# Altium schematic sheet CUSensor.SchDoc
size B; Engineer: Dan Dina; Organization: Altium Limited; Address1: 61 Oakwood Rd.; Address2: Lake Zurich, IL 60047; Revision: C; SheetNumber: 1; SheetTotal: 1; ProjectName: *ProjectName
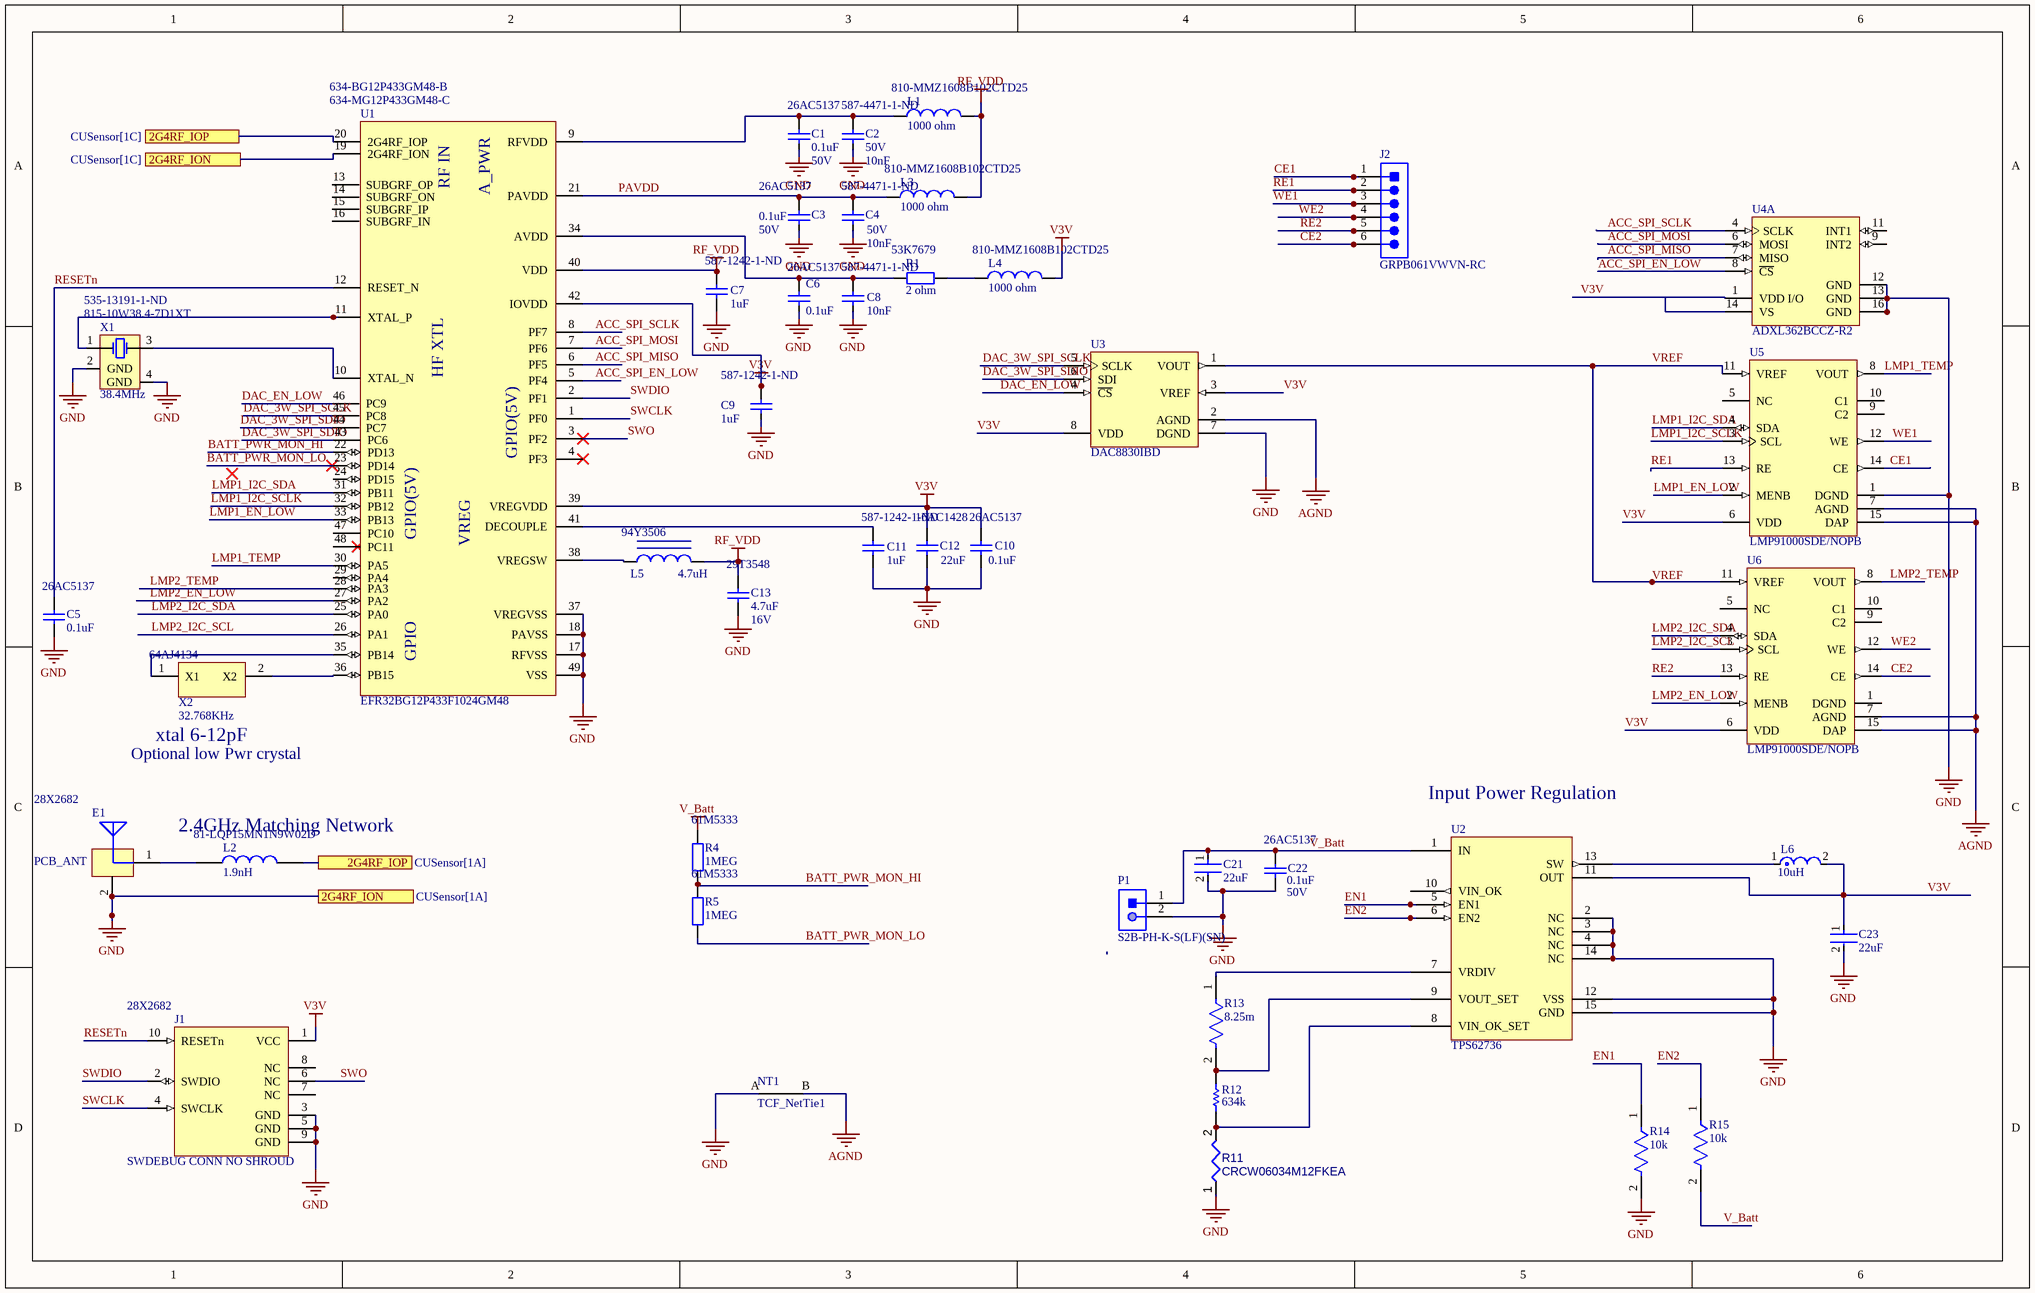
[diagram p0: CUSensor.SchDoc]

## Parts
C1  value 0.1uF  Voltage: 50V  Supplier Part Number 1: 26AC5137  [RESC1608N]  (hidden comment: CAP CER .1UF 50V 10% X7R 0603)
C2  value 10nF  Voltage: 50V  Supplier Part Number 1: 587-4471-1-ND  [RESC1608N]  (hidden comment: CAP CER 10nF 50V 10% X7R 0603)
C3  value 0.1uF  Voltage: 50V  Supplier Part Number 1: 26AC5137  [RESC1608N]  (hidden comment: CAP CER .1UF 50V 10% X7R 0603)
C4  value 10nF  Voltage: 50V  Supplier Part Number 1: 587-4471-1-ND  [RESC1608N]  (hidden comment: CAP CER 10nF 50V 10% X7R 0603)
C5  value 0.1uF  Supplier Part Number 1: 26AC5137  [RESC1608N]  (hidden comment: CAP CER .1UF 50V 10% X7R 0603)
C6  value 0.1uF  Supplier Part Number 1: 26AC5137  [RESC1608N]  (hidden comment: CAP CER .1UF 50V 10% X7R 0603)
C7  value 1uF  Supplier Part Number 1: 587-1242-1-ND  [RESC1608N]  (hidden comment: CAP CER 1UF 10V)
C8  value 10nF  Supplier Part Number 1: 587-4471-1-ND  [RESC1608N]  (hidden comment: CAP CER 10nF 50V 10% X7R 0603)
C9  value 1uF  Supplier Part Number 1: 587-1242-1-ND  [RESC1608N]  (hidden comment: CAP CER 1UF 10V)
C10  value 0.1uF  Supplier Part Number 1: 26AC5137  [RESC1608N]  (hidden comment: CAP CER .1UF 50V 10% X7R 0603)
C11  value 1uF  Supplier Part Number 1: 587-1242-1-ND  [RESC1608N]  (hidden comment: CAP CER 1UF 10V)
C12  value 22uF  Supplier Part Number 1: 16AC1428  [RESC1608N]  (hidden comment: Cap 22uF 0603)
C13  value 4.7uF  Voltage: 16V  Supplier Part Number 1: 29T3548  [RESC1608N]  (hidden comment: CAP 4.7uF  0603)
C21  22uF  [FP-GCJ31C-0_3-IPC_B]
C22  value 0.1uF  Voltage: 50V  Supplier Part Number 1: 26AC5137  [RESC1608N]  (hidden comment: CAP CER .1UF 50V 10% X7R 0603)
C23  22uF  [FP-GCJ31C-0_3-IPC_B]
E1  PCB_ANT  Supplier Part Number 1: 28X2682  [PCB_ANT_2.4GHz CIRCULAR]  (no BOM)
J1  SWDEBUG CONN NO SHROUD  Supplier Part Number 1: 28X2682  [CONN SMT 10 pin Dual Row - 0.050" FCI shroudless]
J2  GRPB061VWVN-RC  [SLIN-GRPB061VWVN-RC_V]
L1  value 1000 ohm  Supplier Part Number 1: 810-MMZ1608B102CTD25  [RESC1608N]  (hidden comment: MMZ1608B102C)
L2  value 1.9nH  Supplier Part Number 1: 81-LQP15MN1N9W02D  [RESC1005N]  (hidden comment: Inductor 1.9nH)
L3  value 1000 ohm  Supplier Part Number 1: 810-MMZ1608B102CTD25  [RESC1608N]  (hidden comment: MMZ1608B102C)
L4  value 1000 ohm  Supplier Part Number 1: 810-MMZ1608B102CTD25  [RESC1608N]  (hidden comment: MMZ1608B102C)
L5  value 4.7uH  Supplier Part Number 1: 94Y3506  [RESC2016N]  (hidden comment: 4.7uH 900mA)
L6  10uH  [FP-LPS4018-MFG]
NT1  TCF_NetTie1  [TCF_NetTie1-Footprint-1]  (net tie, no BOM)
P1  S2B-PH-K-S(LF)(SN)  [JST-S2B-PH-K-S_V]
R1  value 2 ohm  Supplier Part Number 1: 53K7679  [RESC1608N]  (hidden comment: RC1608F2R0CS)
R4  Supplier Part Number 1: 61M5333  [RESC1608N]  (hidden comment: 1MEG)
R5  Supplier Part Number 1: 61M5333  [RESC1608N]  (hidden comment: 1MEG)
R11  CRCW06034M12FKEA  [RESC1608X05N]
R12  634k  [RESC1609X50X30LL10T20]
R13  8.25m  [FP-CRCW0603-e3-IPC_B]
R14  10k  [FP-RT0603-MFG]
R15  10k  [FP-RT0603-MFG]
U1  EFR32BG12P433F1024GM48  Supplier Part Number 1: 634-MG12P433GM48-C  Supplier Part Number 2: 634-BG12P433GM48-B  [QFN50P700X700X90_HS-49N]
U2  TPS62736  [QFN127P600-8N]
U3  DAC8830IBD  [TI-D8_M]
U4  ADXL362BCCZ-R2  [ADI-CC-16-4_M]  (part A of 2)
U5  LMP91000SDE/NOPB  [NHL0014B_V]
U6  LMP91000SDE/NOPB  [NHL0014B_V]
X1  38.4MHz  Supplier Part Number 1: 815-10W38.4-7D1XT  Supplier Part Number 2: 535-13191-1-ND  [CRYSTAL SMD 2.5x2.0 ABRACON]
X2  32.768KHz  Supplier Part Number 1: 64AJ4134  [Crystal_SMD_3.2x1.5mm]

## Ports
2G4RF_ION (see CUSensor[1A]), 2G4RF_ION (see CUSensor[1C]), 2G4RF_IOP (see CUSensor[1A]), 2G4RF_IOP (see CUSensor[1C])

## Nets
AGND: NT1.B U3.2(AGND) U5.7(AGND) U5.15(DAP) U6.7(AGND) U6.15(DAP)
GND: C1.1 C2.1 C3.1 C4.1 C5.2 C6.1 C7.1 C8.1 C9.1 C10.1 C11.1 C12.1 C13.1 C21.2 C22.1 C23.2 E1.2(GND) J1.3(GND) J1.5(GND) J1.9(GND) NT1.A P1.2 R11.1 R14.2 U1.17(RFVSS) U1.18(PAVSS) U1.19(2G4RF_ION) U1.37(VREGVSS) U1.49(VSS) U2.2(NC) U2.3(NC) U2.4(NC) U2.12(VSS) U2.14(NC) U2.15(GND) U3.7(DGND) U4.12(GND) U4.13(GND) U4.16(GND) U5.1(DGND) X1.2(GND) X1.4(GND) ; port 2G4RF_ION
RF_VDD: C7.2 C13.2 L1.2 L3.2 L5.2 U1.40(VDD)
V3V: C9.2 C10.2 C12.2 C23.1 J1.1(VCC) L4.2 L6.2 U1.39(VREGVDD) U1.42(IOVDD) U2.11(OUT) U3.3(VREF) U3.8(VDD) U4.1(VDD_I/O) U4.14(VS) U5.6(VDD) U6.6(VDD)
V_Batt: C21.1 C22.2 P1.1 R4.2 R15.2 U2.1(IN)
2G4RF_IOP: L2.2 U1.20(2G4RF_IOP) ; port 2G4RF_IOP
ACC_SPI_EN_LOW: U1.5(PF4) U4.8(~{CS})
ACC_SPI_MISO: U1.6(PF5) U4.7(MISO)
ACC_SPI_MOSI: U1.7(PF6) U4.6(MOSI)
ACC_SPI_SCLK: U1.8(PF7) U4.4(SCLK)
BATT_PWR_MON_HI: R4.1 R5.2 U1.22(PD13)
BATT_PWR_MON_LO: R5.1 U1.23(PD14)
CE1: J2.1 U5.14(CE)
CE2: J2.6 U6.14(CE)
DAC_3W_SPI_SCLK: U1.45(PC8) U3.5(SCLK)
DAC_3W_SPI_SDIO: U1.43(PC6) U1.44(PC7) U3.6(SDI)
DAC_EN_LOW: U1.46(PC9) U3.4(~{CS})
EN1: R14.1 U2.5(EN1)
EN2: R15.1 U2.6(EN2)
LMP1_EN_LOW: U1.33(PB13) U5.2(MENB)
LMP1_I2C_SCLK: U1.32(PB12) U5.3(SCL)
LMP1_I2C_SDA: U1.31(PB11) U5.4(SDA)
LMP1_TEMP: U1.30(PA5) U5.8(VOUT)
LMP2_EN_LOW: U1.27(PA2) U6.2(MENB)
LMP2_I2C_SCL: U1.26(PA1) U6.3(SCL)
LMP2_I2C_SDA: U1.25(PA0) U6.4(SDA)
LMP2_TEMP: U1.28(PA3) U6.8(VOUT)
PAVDD: C3.2 C4.2 L3.1 U1.21(PAVDD)
RE1: J2.2 U5.13(RE)
RE2: J2.5 U6.13(RE)
RESETn: C5.1 J1.10(RESETn) U1.12(RESET_N)
SWCLK: J1.4(SWCLK) U1.1(PF0)
SWDIO: J1.2(SWDIO) U1.2(PF1)
SWO: J1.6(NC) U1.3(PF2)
VREF: U3.1(VOUT) U5.11(VREF) U6.11(VREF)
WE1: J2.3 U5.12(WE)
WE2: J2.4 U6.12(WE)
NetC1_2: C1.2 C2.2 L1.1 U1.9(RFVDD)
NetC6_2: C6.2 C8.2 R1.1 U1.34(AVDD)
NetC11_2: C11.2 U1.41(DECOUPLE)
NetE1_1: E1.1(SIG) L2.1
NetL4_1: L4.1 R1.2
NetL5_1: L5.1 U1.38(VREGSW)
NetL6_1: L6.1 U2.13(SW)
NetR11_2: R11.2 R12.1 U2.8(VIN_OK_SET)
NetR12_2: R12.2 R13.2 U2.9(VOUT_SET)
NetR13_1: R13.1 U2.7(VRDIV)
NetU1_10: U1.10(XTAL_N) X1.3(OSC2)
NetU1_11: U1.11(XTAL_P) X1.1(OSC1)
NetU1_35: U1.35(PB14) X2.1(X1)
NetU1_36: U1.36(PB15) X2.2(X2)

Not connected (* = marked no-connect by the designer): J1 7(NC) 8(NC); U1 4(PF3)* 13(SUBGRF_OP) 14(SUBGRF_ON) 15(SUBGRF_IP) 16(SUBGRF_IN) 24(PD15) 29(PA4) 47(PC10) 48(PC11); U2 10(VIN_OK); U4 9(INT2) 11(INT1); U5 5(NC) 9(C2) 10(C1); U6 1(DGND) 5(NC) 9(C2) 10(C1)

## Notes on the sheet
- Optional low Pwr crystal
- (near X2) xtal 6-12pF
- (near L2) 2.4GHz Matching Network
- (near U2) Input Power Regulation
- (in symbol EFR32BG12P433F1024GM48) RF IN; A_PWR; HF XTL; GPIO(5V); VREG; GPIO

## Library data of the parts
C1 C3 C5 C6 C10 C22 = Cap Ceramic 0.1uF 0603_50V: Manufacturer: Murata; Manufacturer part#: GRM188R71H104KA93D; Note: Footprint corresponds to dimensions for bulk cassette packaging. This case size has tightened tolerances.; PackageDocument: Mar-2001; PackageReference: 0603; Cost: $0.006; Digikey Part#: 490-1519-2-ND; Supplier 1: Newark
  C5 C6 C10: Voltage: 50V
C2 C4 C8 = Cap Ceramic 10nF 0603: CAP CER 10000PF 50V 10% X7R 0603; Manufacturer: Murata; Manufacturer part#: GRM188R71H103KA01D; PackageReference: 0603; Cost: $0.005; Digikey Part#: 490-1512-1-ND; Supplier 1: Digi-Key
  C8: Voltage: 50V
C7 C9 C11 = Cap Ceramic 1uF_10V_ 0603: CAP CER 1UF 10V 10% X7R 0603; Manufacturer: Taiyo-Yuden; Manufacturer part#: LMK107B7105KA-T; PackageReference: 0603; Cost: 0.007; Digikey Part#: 587-1242-2-ND; Voltage: 10V; Supplier 1: Digi-Key
C12 = Cap Ceramic 22uF 0603 6.3V: CAP CER 22UF 6.3V 20% X5R 0603; Manufacturer: Samsung Electro-Mechanics America; Manufacturer part#: CL10A226MQ8NRNE; PackageReference: 0603; Cost: $0.051; Digikey Part#: 1276-2868-2-ND; Voltage: 6.3V; Supplier 1: Newark
C13 = Cap Ceramic 4.7UF 16V 0603: CAP CER 4.7UF 16V 10% X5R 0603; Manufacturer: Taiyo Yuden; Manufacturer part#: EMK107ABJ475KA-T; PackageReference: 0603; Cost: $0.047; Digikey Part#: 587-2786-2-ND; Supplier 1: Newark
C21 C23 = CMP-06035-051043-1: Cap Ceramic 22uF 10V X7R 10% Pad SMD 1206 Soft Termination  +125°C Automotive T/R
E1 = Antenna_2.4GHZ_Printed_Copper_Circular: Antenna 2.4GHz_PCB Printed; Value: 50 Ohm; COST: $0.0; Supplier 1: Avnet
J1 = CONN JTAG SMT NO SHROUD NXP: CONN HEADER 10POS DL UNSHRD SMD; Manufacturer: FCI; Manufacturer Part#: 20021121-00010C4LF; Note: 2x5; COST: $0.60; Digikey Part#: 609-3695-1-ND; PackageReference: SMT_2x5_050"; Supplier 1: Avnet
J2 = CMP-2000-06374-1: Male Header, Pitch 1.27 mm, 1 x 6 Position, Height 4 mm, Tail Length 2.3 mm, -40 to 105 degC, RoHS, Bulk; Manufacturer: Sullins; Other Names: S9014E-06; Number of Positions Loaded: All; Pitch: 0.050"(1.27mm); Connector Type: Header,Unshrouded; Mating Products: S9010E-06-ND / -CONNHEADER.050"6POSR/APCB / S9008E-06-ND / -CONNHEADER.050"6POSPCBGOLD / S9005E-06-ND / -CONNHEADER.050"6POSSMDGOLD; Dynamic Catalog: GRPB; Number of Positions: 6; Catalog Drawings: S9014ESeriesTop; Family: RectangularConnectors-Headers,MalePins; Contact Mating Length: 0.118"(3.00mm); Termination: Solder; Contact Finish: Gold; Manufacturer URL: http://www.sullinscorp.com/; Category: Connectors,Interconnects; Package Description: Male Header, Pitch 1.27 mm, 1 x 6 Position, Height 4 mm, Tail Length 2.3 mm; Standard Package: 1; Packaging: Bulk; Datasheet Version: Rev. C, 12/2008; Contact Type: MalePin; Number of Rows: 1; Package Reference: GRPB061VWVN-RC; Mounting Technology: ThroughHole; Contact Finish Thickness: Flash; Datasheet URL: http://www.sullinscorp.com/drawings/71_GRPB___1VWVN-RC,_10957-C.pdf; Mounting Type: ThroughHole
L1 L3 L4 = Ind Filter 0.3A_0603: FERRITE CHIP 1000 OHM 300MA 0603; Manufacturer: TDK; PackageReference: 0603; Cost: $0.025; Digikey Part#: 445-8672-1-ND; Manufacturer Part#: MMZ1608B102C; Imax: 300mA; Supplier 1: Mouser
L2 = Ind Signal 1.9nH 220mA 300mohm 0402: Manufacturer: Murata; Manufacturer Part#: LQP15MN1N9W02D; PackageReference: 0402; Cost: $0.09; Digikey Part#: 490-11739-6-ND; Supplier 1: Mouser
L5 = IND PWR 4.7uH 900mA 360mohm 0806: FIXED IND 4.7UH 900MA 360 MOHM; Manufacturer: Bourns; Manufacturer Part#: SRN2010TA-4R7M; Current Rating: 1.6A; Cost: $0.50; Vendor part#: *; DatasheetDocument: *; Note: *; PackageDocument: *; DCR: 360 mOhm; INSTRON PN: *; Isat: 900mA; Digikey Part#: SRN2010TA-4R7MCT-ND; PackageReference: 0806; Supplier 1: Newark
L6 = CMP-11268-000063-1: Shielded Power Inductors; Inductance Tolerance: 20%; Test Frequency: 100kHz; Max DC Current: 1.3A; Core Material: Ferrite; DC Resistance (DCR): 200mR; RMS Current (Irms): 900mA; Saturation Current: 1.2A; Self Resonant Frequency: 40MHz; Tolerance: 20%; Inductance: 10uH; Max Operating Temperature: 85°C; Package Quantity: 1; Shielding: Shielded; Termination: SMD/SMT; Length: 4mm; Packaging: Cut Tape; Height: 1.7mm; Width: 4mm; Weight: 0.003527oz; REACH SVHC: No SVHC; Min Operating Temperature: -40°C
NT1 = CMP-001-0001-3: A Net Tie
P1 = CMP-1755-00004-1: Male Header, Pitch 2 mm, 1 x 2 Position, Height 4.8 mm, Tail Length 3.4 mm, -25 to 85 degC, RoHS, Bulk; Case\Package: Radial; Tolerance: 20%; Capacitance: 10 uF; Voltage Rating (DC): 50 V; Packaging: Bulk; ComponentLink1URL: http://www.jst-mfg.com/product/pdf/eng/ePH.pdf; Radiation Hardening: No; Height: 11 mm; Package Quantity: 200; PackageDescription: Male Header, Pitch 2 mm, 1 x 2 Position, Height 4.8 mm, Tail Length 3.4 mm; PackageReference: S2B-PH-K-S; Diameter: 5 mm; Pins: 2; Mount: Through Hole; Max Operating Temperature: 85 degC; Min Operating Temperature: -40 degC; ComponentLink1Description: Datasheet; DatasheetVersion: Dec-12; Length: 11 mm; Lead Pitch: 2 mm; REACH SVHC: No SVHC; Voltage Rating: 50 V; RoHSCompliant: true
R1 = RES SMT 2 ohm  1% 0603: RES SMD 2 OHM 1% 1/10W 0603; Manufacturer: Samsung; Note: +/-1%; PackageReference: 0603; COST: $0.001; Digikey Part#: 1276-4476-1-ND; Manufacturer Part#: RC1608F2R0CS; Supplier 1: Newark
R4 R5 = RES SMT 1MEG 1% 0603: RES SMD 1M OHM 1% 1/10W 0603; Manufacturer: Panasonic; Manufacturer Part#: ERJ-3EKF1004V; Note: +/-1%; PackageReference: 0603; COST: $0.002; Digikey Part#: P1.00MHTR-ND; Value: 1MEG; Supplier 1: Newark
R11 = CMP-009-00178-1: RES SMD 4.12M OHM 1% 1/10W 0603; Manufacturer: Vishay; Description: Res Thick Film 0603 4.12M Ohm 1% 1/10W ±100ppm/°C Molded SMD SMD Paper T/R; Resistance: 4.12MR; Temperature Coefficient: 100ppm/°C; Power Rating: 100mW; Voltage Rating: 75V; Supplier 1: Newark; Manufacturer Part Number: CRCW06034M12FKEA; RoHS: Yes; Category: Chip SMD Resistors; Stock 1: 18605; Pricing 1: 1=0.00200, 25=0.00200, 50=0.00200, 100=0.00200 (USD); Case/Package: 0603; Number of Pins: 2; Contact Plating: Tin; Weight: 7.1E-05oz; Case Code (Imperial): 0603; Case Code (Metric): 1608; Min Operating Temperature: -55°C; Max Operating Temperature: 155°C; Tolerance: 1%; Resistor Type: Thick Film; Packaging: Tape and Reel; Package Quantity: 10; Termination: SMD/SMT; Number of Terminations: 2; Max Power Dissipation: 100mW; Voltage Rating (DC): 75V; Features: Automotive AEC-Q200; Series: CRCW; Resistance Tolerance: 1%; Construction: Rectangular; Length: 0.061inch; Width: 0.033inch; Height: 0.02inch; Depth: 0.85mm; Ratings: AEC-Q200; Radiation Hardening: No; RoHS Compliant: Yes; Military Standard: Not; Lead Free: Lead Free; ComponentLink1URL: https://datasheet.ciiva.com/9074/dcrcwe3-9074669.pdf?src-supplier=Avnet; ComponentLink1Description: https://datasheet.ciiva.com/9074/dcrcwe3-9074669.pdf?src-supplier=Avnet; ComponentLink2URL: https://datasheet.ciiva.com/2494/dcrcwe3-2494873.pdf?src-supplier=Digi-Key; ComponentLink2Description: https://datasheet.ciiva.com/2494/dcrcwe3-2494873.pdf?src-supplier=Digi-Key; ComponentLink3URL: https://datasheet.ciiva.com/2494/dcrcwe3-2494874.pdf?src-supplier=Digi-Key; ComponentLink3Description: https://datasheet.ciiva.com/2494/dcrcwe3-2494874.pdf?src-supplier=Digi-Key; ComponentLink4URL: https://datasheet.ciiva.com/2494/dcrcwe3-2494875.pdf?src-supplier=Digi-Key; ComponentLink4Description: https://datasheet.ciiva.com/2494/dcrcwe3-2494875.pdf?src-supplier=Digi-Key; ComponentLink5URL: https://datasheet.ciiva.com/7843/1697337-7843294.pdf?src-supplier=Element14; ComponentLink5Description: https://datasheet.ciiva.com/7843/1697337-7843294.pdf?src-supplier=Element14; ComponentLink6URL: https://datasheet.ciiva.com/7843/1697337-7843295.pdf?src-supplier=Element14; ComponentLink6Description: https://datasheet.ciiva.com/7843/1697337-7843295.pdf?src-supplier=Element14; ComponentLink7URL: https://datasheet.ciiva.com/22676/1700796-22676825.pdf?src-supplier=Element14; ComponentLink7Description: https://datasheet.ciiva.com/22676/1700796-22676825.pdf?src-supplier=Element14; ComponentLink8URL: https://datasheet.ciiva.com/22704/1697337-22704007.pdf?src-supplier=Element14; ComponentLink8Description: https://datasheet.ciiva.com/22704/1697337-22704007.pdf?src-supplier=Element14
R12 = CMP-1012-00827-2: Part Number: CRCW0603634KFKEA; Manufacturer: Vishay Dale
R13 = CMP-02407-005912-1: RES Thick Film, 8.25MΩ, 1%, 0.1W, 100ppm/°C, 0603; Voltage Rating (DC): 75V; Resistance: 8.25MR; Power Rating: 100mW; Tolerance: 1%; Lead Free: Lead Free; Package Quantity: 10; Depth: 0.85mm; Length: 1.55mm; Max Operating Temperature: 155°C; Composition: Thick Film; Width: 0.033inch; Termination: SMD/SMT; Contact Plating: Tin; Min Operating Temperature: -55°C; Features: Automotive AEC-Q200; Temperature Coefficient: 100ppm/°C; Case Code (Metric): 1608; Military Standard: Not; Number of Terminations: 2; Case Code (Imperial): 0603; Height: 0.02inch; Packaging: Tape and Reel; Weight: 7.1E-05oz; Radiation Hardening: No; Voltage Rating: 75V; Case/Package: 0603; Max Power Dissipation: 100mW
R14 R15 = CMP-2000-04517-2: RES SMD 10K OHM 0.1% 1/10W 0603; Manufacturer Part Number: RT0603BRE0710KL; Manufacturer: Yageo; Tolerance: 0.001; Temperature Coefficient: 50 ppm/°C; Power Rating: 0.1W; Resistance: 10KΩ; Value: 10KΩ; Voltage Rating: 75V; Temperature Range High: +155°C; Device Class L2: Resistors; Temperature: -55°C to +155°C; Series: RT; Device Class L1: Passive Components; Temperature Range Low: -55°C; Automotive: No; Mouser Description: Res Thin Film 0603 10K Ohm 0.1% 1/10W ±50ppm/°C Molded SMD SMD Paper T/R; Device Class L3: Chip SMD Resistors; RoHS: TRUE; Package: RT0603; Footprint Url: http://www.yageo.com/exep/pages/download/literatures/PYu-R_Mount_10.pdf; Octopart: https://octopart.com/rt0603bre0710kl-yageo-1273959; ComponentLink2URL: http://www.yageo.com/documents/recent/PYu-RT_1-to-0.01_RoHS_L_9.pdf; Composition: Thin Film; Category: Res; Lead Free: Yes; Height: 0.55mm; Digikey Description: RES SMD 10K OHM 0.1% 1/10W 0603; Ipc Land Pattern Name: RESC16080X45; ComponentLink2Description: Datasheet
U2 = CMP-019-00051-4: High Efficiency Nanopower Buck Converter with 50mA Load Capability
U3 = CMP-0004-00140-1: 16-Bit, Ultra-Low Power, Voltage Output Digital to Analog Converter, -40 to 85 degC, 8-pin SOIC (D8), Green (RoHS & no Sb/Br); Manufacturer: Texas Instruments; DAC Channels: 1; SubFamily: Precision DAC (=<10MSPS); Power Consumption(Typ)(mW): 0.015; Interface: Serial SPI; INL(Max)(+/-LSB): 2; Resolution(Bits): 16; PackageVersion: 4040047-3/M, 06/2011; DNL(Max)(+/-LSB): 1; Settling Time(us): 1; DatasheetVersion: SLAS449D; ComponentLink3Description: Package Specification; ComponentLink3URL: http://www.ti.com/litv/pdf/msoi002j; PackageDescription: 8-Pin Plastic Small Outline, Body 4.9 x 3.9 mm, Pitch 1.27 mm; ComponentLink2URL: http://www.ti.com/general/docs/lit/getliterature.tsp?genericPartNumber=DAC8830&fileType=pdf; ComponentLink2Description: Datasheet; Eco-Plan: Green (RoHS & no Sb/Br); ComponentLink1URL: http://www.ti.com/; PackageReference: D8; Code_JEDEC: MS-012; Mounting Technology: Surface Mount; ComponentLink1Description: Manufacturer URL; PartNumber: DAC8830IBD
U4 = CMP-0885-00039-1: Micropower, 3-Axis, +/-2 g / +/-4 g / +/-8 g Digital Output MEMS Accelerometer with 200 Hz BW, Industrial, 16-pin LGA, Reel; Manufacturer: Analog Devices; Voltage Supply (V): 1.6 to 3.5; Supply Current: 1.8 uA; Sensitivity: 1/2/4 mg/LSB; # of Axes: 3; -3dB Bandwidth: 200 Hz; ComponentLink3URL: http:/www.analog.com/static/imported-files/packages/PKG_PDF/LGA(CC)/CC_16_4.pdf; ComponentLink1URL: http://www.analog.com/en/index.html; PackageDescription: 16-Pin Land Grid Array, 3.25 x 3 mm Body, 0.5 mm Pitch; ComponentLink2Description: Datasheet; ComponentLink2URL: http://www.analog.com/static/imported-files/data_sheets/ADXL362.pdf; DatasheetVersion: Rev. B; ComponentLink4URL: http://www.analog.com/en/mems-sensors/mems-inertial-sensors/adxl362/products/product.html; Packing: Reel; PartNumber: ADXL362BCCZ-R2; ComponentLink1Description: Manufacturer URL; ComponentLink3Description: Package Specification; PackageReference: CC-16-4; Output Type: Digital; ComponentLink4Description: Product URL; Mounting Technology: Surface Mount; PackageVersion: 10-23-2012-A, 10/2012
U5 U6 = CMP-0064-00201-2: Configurable AFE Potentiostat for Low-Power Chemical Sensing Applications, 14-pin LLP, 250 Reel; Manufacturer: Texas Instruments; PowerWise: N; PackageTopMarking: NS*UZXYTT*L91000; CompType: OtherParts; PackageDescription: LLP, Plastic, Dual, 4 x 4 x 0.8mm Body, 14 Lead, 0.5mm Pitch, No Pullback; ComponentLink1URL: http://www.ti.com/general/docs/lit/getliterature.tsp?genericPartNumber=LMP91000&fileType=pdf; ComponentLink1Description: Datasheet URL; PinCount: 14; RoHS: Y; PackageReference: NHL0014B
X1 = CRYSTAL 38.4MHZ 7PF_SMD_2.5mmx2mm: CRYSTAL 38.4MHZ 7pF; Manufacturer: Abracon; Manufacturer Part#: ABM10W-38.4000MHZ-7-D1X-T3; PackageReference: 4-SMD; COST: $0.42; Digikey Part#: 535-13784-2-ND; Supplier 1: Mouser; Supplier 2: Digi-Key
X2 = Crystal_32.768KHz 12.5pF SMD 3.2x1.5mm ECS ECS-.327-12.5-34B-TR: CRYSTAL 32.7680KHZ 12.5PF SMD; Manufacturer: ECS; COST: $0.244; Digikey Part#: XC1617TR-ND; PackageReference: SMD_3.2x1.5; Manufacturer Part#: ECS-.327-12.5-34B-TR; CPAR: 12.5pF; Supplier 1: Newark
U1 = EFR32BG12P433F1024GM48: Supplier 1: Mouser; Supplier 2: Mouser